# EAGLE design HeartRateSensor Eval Board - Si1141 (EAGLE 7.1.0)
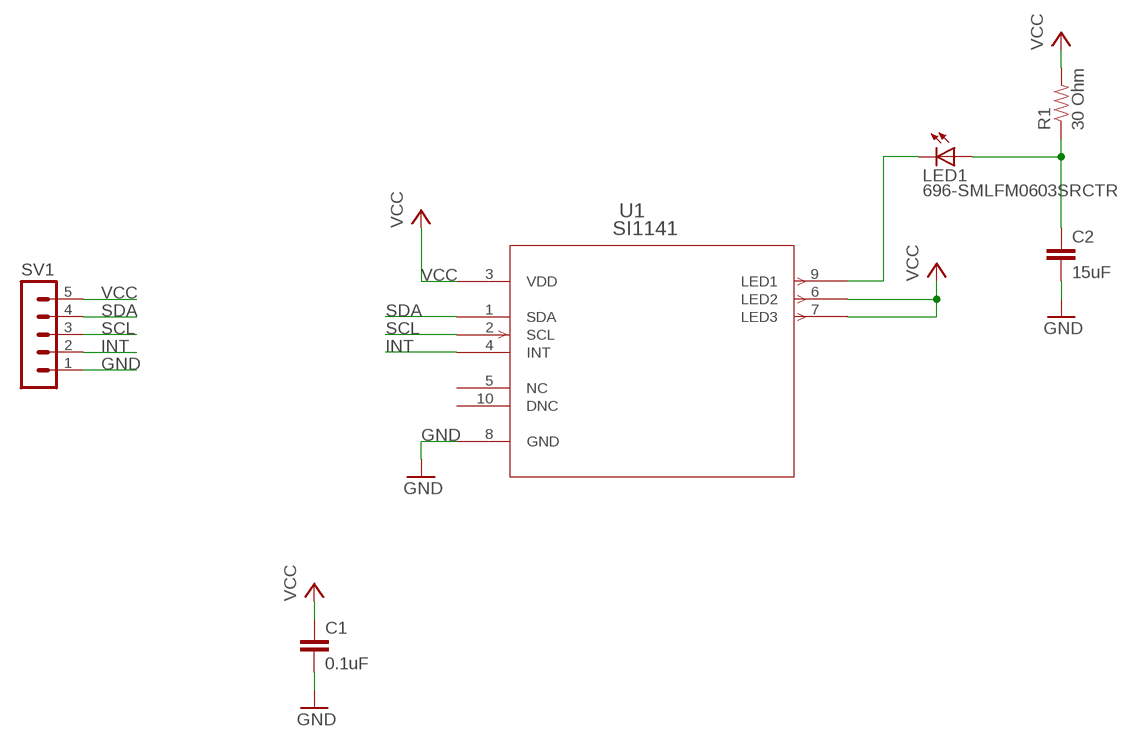
[diagram p0: schematic, sheet 1]

## Parts
C1  0.1uF  0.1UF-100V-10%(0603)  [0603-CAP]
C2  15uF  0.1UF-100V-10%(0603)  [0603-CAP]
LED1  696-SMLFM0603SRCTR  LEDCHIP-LED0603  [CHIP-LED0603]
R1  30 Ohm  0OHM1/10W5%(0603)  [0603]
SV1  MA05-1  [MA05-1]
U1  SI1141  [QFN10]

## Nets
GND: C1.2 C2.2 SV1.1 U1.8(GND)
INT: SV1.2 U1.4(INT)
N$1: LED1.C U1.9(LED1)
N$2: C2.1 LED1.A R1.1
SCL: SV1.3 U1.2(SCL)
SDA: SV1.4 U1.1(SDA)
VCC: C1.1 R1.2 SV1.5 U1.3(VDD) U1.6(LED2) U1.7(LED3)
Unconnected: U1.5(NC) U1.10(DNC)

## Library data of the parts
C1 = SparkFun-Capacitors:0.1UF-100V-10%(0603): CAP-08390; PROD_ID: CAP-08390
C2 = SparkFun-Capacitors:0.1UF-100V-10%(0603): CAP-08390; PROD_ID: CAP-08390; VALUE: 0.1uF
LED1 = adafruit:LED: LED OSRAM: - CHIPLED LG R971, LG N971, LY N971, LG Q971, LY Q971, LO R971, LY R971 LH N974, LH R974 LS Q976, LO Q976, LY Q976 LO Q996 - Hyper CHIPLED LW Q18S LB Q993, LB Q99A, LB R99A - SideLED LS A670, LO A670, LY A670, LG A670, LP A670 LB A673, LV A673, LT A673, LW A673 LH A674 LY A675 LS A676, LA A676, LO A676, LY A676, LW A676 LS A679, LY A679, LG A679 - Hyper Micro SIDELED® LS Y876, LA Y876, LO Y876, LY Y876 LT Y87S - SmartLED LW L88C, LW L88S LB L89C, LB L89S, LG L890 LS L89K, LO L89K, LY L89K LS L896, LA L896, LO L896, LY L896 - TOPLED LS T670, LO T670, LY T670, LG T670, LP T670 LSG T670, LSP T670, LSY T670, LOP T670, LYG T670 LG T671, LOG T671, LSG T671 LB T673, LV T673, LT T673, LW T673 LH T674 LS T676, LA T676, LO T676, LY T676, LB T676, LH T676, LSB T676, LW T676 LB T67C, LV T67C, LT T67C, LS T67K, LO T67K, LY T67K, LW E67C LS E67B, LA E67B, LO E67B, LY E67B, LB E67C, LV E67C, LT E67C LW T67C LS T679, LY T679, LG T679 LS T770, LO T770, LY T770, LG T770, LP T770 LB T773, LV T773, LT T773, LW T773 LH T774 LS E675, LA E675, LY E675, LS T675 LS T776, LA T776, LO T776, LY T776, LB T776 LHGB T686 LT T68C, LB T68C - Hyper Mini TOPLED® LB M676 - Mini TOPLED Santana® LG M470 LS M47K, LO M47K, LY M47K Source: http://www.osram.convergy.de/
R1 = SparkFun-Resistors:0OHM1/10W5%(0603): RES-08609; PROD_ID: RES-08609; VALUE: 0
SV1 = con-lstb:MA05-1: PIN HEADER; OC_FARNELL: unknown; OC_NEWARK: unknown
U1 = silabs-si1411:SI1141

## Board
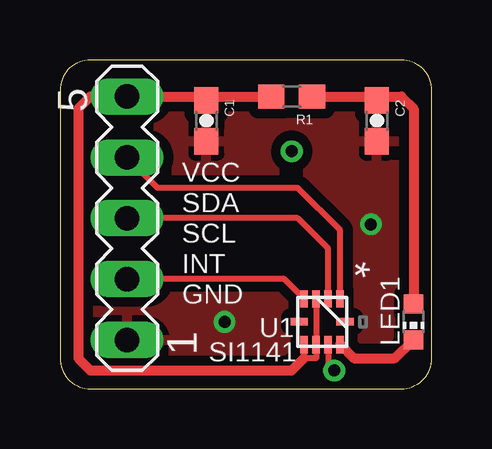
[diagram p1: board, top side]
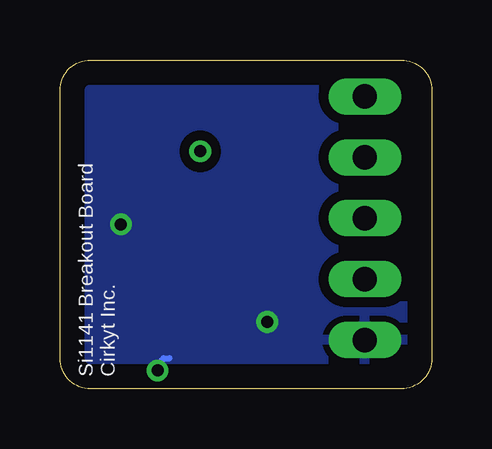
[diagram p2: board, bottom side, seen from below]

Size 15.49 x 13.72 mm. Coordinates in mm from the lower left corner, seen from the top.
Outline: 14.22,13.72 1.27,13.72 arc90 0,12.45 0,1.27 arc90 1.27,0 14.22,0 arc90 15.49,1.27 15.49,12.45 arc90 14.22,13.72
Copper layers (1*16): Top 0.035mm / dielectric 1.5mm / Bottom 0.035mm
Design rules "default": minimum track width 10mil, minimum drill 24mil, track to track 8mil, track to pad 8mil, pad to pad 8mil, via to via 8mil, smd to smd 8mil, copper to edge 40mil, drill to drill 8mil, minimum pad ring 10mil, minimum via ring 8mil, stop-mask expansion 4mil, vias tented up to drill 0mil, thermal gap 10mil

### Footprints (pad centres in the part's own frame; a part is rotated, then mirrored left to right if it is on the bottom)
0603-CAP = smd 1.1 x 1: 1 -0.85,0; 2 0.85,0
CHIP-LED0603 = smd 0.8 x 0.8: A 0,-0.75; C 0,0.75
0603 = smd 1.1 x 1: 1 -0.85,0; 2 0.85,0
MA05-1 = drill 1.016 long: 1 -5.08,0; 2 -2.54,0; 3 0,0; 4 2.54,0; 5 5.08,0
QFN10 = smd 0.711 x 0.305: 1 -0.953,0.75; 2 -0.953,0.25; 3 -0.953,-0.25; 4 -0.953,-0.75; 6 0.953,-0.75; 7 0.953,-0.25; 8 0.953,0.25; 9 0.953,0.75 | smd 0.305 x 0.711: 5 0,-0.953; 10 0,0.953

### Placement (x,y rotation side)
C1  6.1,11.18 270 top
C2  13.21,11.18 270 top
LED1  14.73,2.79 180 top
R1  9.65,12.19 180 top
SV1  2.79,7.11 90 top
U1  10.92,2.79 270 top

### Tracks (layer width: path | path; a pad name or v marks a point on that pad's centre or on a via)
GND  (via drill 0.5)
  Top 0.254: U1.8 11.17,1.78 11.18,1.78 11.18,1.02 v11.43,0.76
  Bottom 0.254: v11.43,0.76 11.43,1.02 11.18,1.27 10.92,1.27
  other vias: 6.86,2.79 12.95,6.86
  pour Top (isolate 0.406): 0,12.45 arc-90 1.27,13.72 14.22,13.72 arc-90 15.49,12.45 15.49,1.27 arc-90 14.22,0 1.27,0 arc-90 0,1.27
  pour Bottom (isolate 0.406): 0,12.45 arc-90 1.27,13.72 14.22,13.72 arc-90 15.49,12.45 15.49,1.27 arc-90 14.22,0 1.27,0 arc-90 0,1.27
INT
  Top 0.254: U1.4 9.35,4.57 SV1.2
N$1
  Top 0.406: U1.9 12.24,1.27 13.96,1.27 LED1.C
N$2
  Top 0.406: R1.1 13.04,12.19 C2.1 13.37,12.19 14.22,12.19 14.73,11.68 LED1.A
N$5  (via drill 0.5)
  other vias: 9.65,9.91
SCL
  Top 0.254: U1.2 11.18,5.84 9.91,7.11 SV1.3
SDA
  Top 0.254: U1.1 11.67,6.62 9.91,8.38 4.06,8.38 SV1.4
VCC
  Top 0.254: U1.3 U1.7 10.67,1.27 10.16,1.27 10.17,1.28 U1.6
  Top 0.406: R1.2 6.26,12.19 C1.1 5.93,12.19 SV1.5 1.27,12.19 0.76,11.68 0.76,1.27 1.27,0.76 9.65,0.76 10.16,1.27

### Text on the board
tPlace: VCC | SDA | SCL | INT | GND
bPlace: Si1141 Breakout Board / Cirkyt Inc.